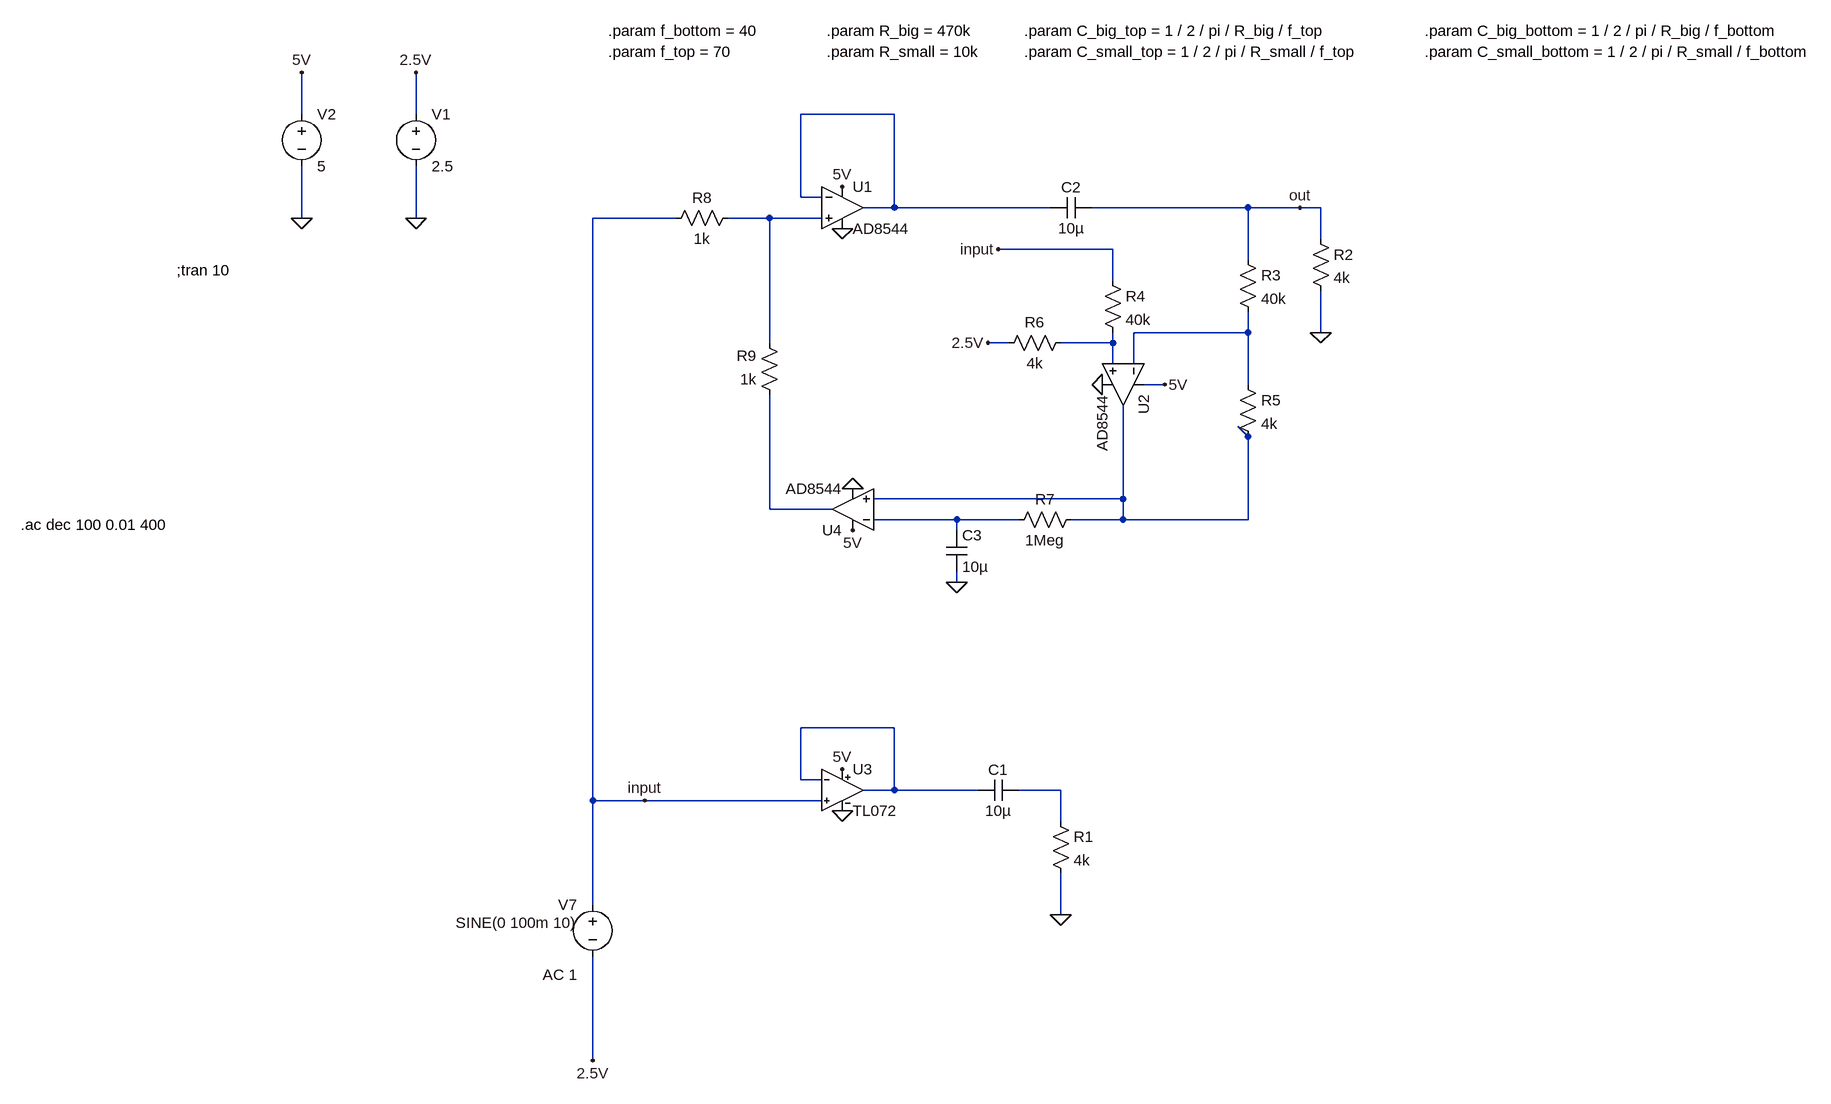
[diagram p0: schematic HP_ac.asc]
HP_ac.asc, the LTspice schematic file:
Version 4
SHEET 1 2972 1716
WIRE -1456 -272 -1456 -336
WIRE -1280 -272 -1280 -336
WIRE -544 -272 -688 -272
WIRE -688 -144 -688 -272
WIRE -656 -144 -688 -144
WIRE -544 -128 -544 -272
WIRE -544 -128 -592 -128
WIRE -304 -128 -544 -128
WIRE 0 -128 -240 -128
WIRE 80 -128 0 -128
WIRE 112 -128 80 -128
WIRE -1456 -112 -1456 -192
WIRE -1280 -112 -1280 -192
WIRE -880 -112 -1008 -112
WIRE -736 -112 -800 -112
WIRE -656 -112 -736 -112
WIRE 112 -80 112 -128
WIRE -208 -64 -384 -64
WIRE 0 -48 0 -128
WIRE -208 -16 -208 -64
WIRE 0 64 0 32
WIRE 0 64 -176 64
WIRE 112 64 112 0
WIRE -736 80 -736 -112
WIRE -368 80 -400 80
WIRE -208 80 -208 64
WIRE -208 80 -288 80
WIRE -208 112 -208 80
WIRE -176 112 -176 64
WIRE -128 144 -160 144
WIRE 0 144 0 64
WIRE 0 224 -16 208
WIRE -192 320 -192 176
WIRE -192 320 -576 320
WIRE -736 336 -736 160
WIRE -640 336 -736 336
WIRE -448 352 -576 352
WIRE -352 352 -448 352
WIRE -192 352 -192 320
WIRE -192 352 -272 352
WIRE 0 352 0 224
WIRE 0 352 -192 352
WIRE -448 368 -448 352
WIRE -448 448 -448 432
WIRE -544 672 -688 672
WIRE -688 752 -688 672
WIRE -656 752 -688 752
WIRE -544 768 -544 672
WIRE -544 768 -592 768
WIRE -416 768 -544 768
WIRE -288 768 -352 768
WIRE -1008 784 -1008 -112
WIRE -928 784 -1008 784
WIRE -656 784 -928 784
WIRE -288 816 -288 768
WIRE -1008 944 -1008 784
WIRE -288 960 -288 896
WIRE -1008 1184 -1008 1024
FLAG -1456 -112 0
FLAG -1456 -336 5V
FLAG -1280 -112 0
FLAG -1280 -336 2.5V
FLAG -624 800 0
FLAG -624 736 5V
FLAG -1008 1184 2.5V
FLAG -288 960 0
FLAG -624 -96 0
FLAG -624 -160 5V
FLAG 112 64 0
FLAG -928 784 input
FLAG 80 -128 out
FLAG -224 144 0
FLAG -128 144 5V
FLAG -384 -64 input
FLAG -400 80 2.5V
FLAG -448 448 0
FLAG -608 304 0
FLAG -608 368 5V
SYMBOL voltage -1456 -288 R0
WINDOW 123 0 0 Left 0
WINDOW 39 0 0 Left 0
SYMATTR InstName V2
SYMATTR Value 5
SYMBOL voltage -1008 928 M0
WINDOW 123 24 124 Left 2
WINDOW 39 0 0 Left 0
WINDOW 3 24 44 Left 2
SYMATTR Value2 AC 1
SYMATTR InstName V7
SYMATTR Value SINE(0 100m 10)
SYMBOL voltage -1280 -288 R0
WINDOW 123 0 0 Left 0
WINDOW 39 0 0 Left 0
SYMATTR InstName V1
SYMATTR Value 2.5
SYMBOL ZZZ\\OpAmp\\TL072 -624 768 R0
SYMATTR InstName U3
SYMBOL cap -352 752 R90
WINDOW 0 0 32 VBottom 2
WINDOW 3 32 32 VTop 2
SYMATTR InstName C1
SYMATTR Value 10µ
SYMBOL res -304 800 R0
SYMATTR InstName R1
SYMATTR Value 4k
SYMBOL cap -240 -144 R90
WINDOW 0 0 32 VBottom 2
WINDOW 3 32 32 VTop 2
SYMATTR InstName C2
SYMATTR Value 10µ
SYMBOL res 96 -96 R0
SYMATTR InstName R2
SYMATTR Value 4k
SYMBOL OpAmps\\AD8544 -624 -192 R0
SYMATTR InstName U1
SYMBOL OpAmps\\AD8544 -128 144 R90
SYMATTR InstName U2
SYMBOL res -16 -64 R0
SYMATTR InstName R3
SYMATTR Value 40k
SYMBOL res -224 -32 R0
SYMATTR InstName R4
SYMATTR Value 40k
SYMBOL res -16 128 R0
SYMATTR InstName R5
SYMATTR Value 4k
SYMBOL res -272 64 R90
WINDOW 0 0 56 VBottom 2
WINDOW 3 32 56 VTop 2
SYMATTR InstName R6
SYMATTR Value 4k
SYMBOL res -256 336 R90
WINDOW 0 0 56 VBottom 2
WINDOW 3 32 56 VTop 2
SYMATTR InstName R7
SYMATTR Value 1Meg
SYMBOL cap -464 368 R0
SYMATTR InstName C3
SYMATTR Value 10µ
SYMBOL OpAmps\\AD8544 -608 400 R180
SYMATTR InstName U4
SYMBOL res -784 -128 R90
WINDOW 0 0 56 VBottom 2
WINDOW 3 32 56 VTop 2
SYMATTR InstName R8
SYMATTR Value 1k
SYMBOL res -720 176 R180
WINDOW 0 36 76 Left 2
WINDOW 3 36 40 Left 2
SYMATTR InstName R9
SYMATTR Value 1k
TEXT -1648 -32 Left 2 !;tran 10
TEXT -1888 360 Left 2 !.ac dec 100 0.01 400
TEXT -984 -400 Left 2 !.param f_bottom = 40
TEXT -984 -368 Left 2 !.param f_top = 70
TEXT -648 -400 Left 2 !.param R_big = 470k
TEXT -648 -368 Left 2 !.param R_small = 10k
TEXT -344 -400 Left 2 !.param C_big_top = 1 / 2 / pi / R_big / f_top
TEXT -344 -368 Left 2 !.param C_small_top = 1 / 2 / pi / R_small / f_top
TEXT 272 -400 Left 2 !.param C_big_bottom = 1 / 2 / pi / R_big / f_bottom
TEXT 272 -368 Left 2 !.param C_small_bottom = 1 / 2 / pi / R_small / f_bottom

The netlist it stands for:
* HP_ac.asc
V2 5V 0 5
V7 input 2.5V SINE(0 100m 10) AC 1
V1 2.5V 0 2.5
XU3 input N008 5V 0 N008 TL072  ; pins 1 2 3 4 5
C1 N009 N008 10µ
R1 N009 0 4k
C2 out N001 10µ
R2 out 0 4k
XU1 N002 N001 5V 0 N001 AD8544  ; pins In+ In- V+ V- OUT
XU2 N004 N003 5V 0 N005 AD8544  ; pins In+ In- V+ V- OUT
R3 out N003 40k
R4 input N004 40k
R5 N003 N005 4k
R6 N004 2.5V 4k
R7 N005 N007 1Meg
C3 N007 0 10µ
XU4 N005 N007 5V 0 N006 AD8544  ; pins In+ In- V+ V- OUT
R8 N002 input 1k
R9 N006 N002 1k
;tran 10
.ac dec 100 0.01 400
.param f_bottom = 40
.param f_top = 70
.param R_big = 470k
.param R_small = 10k
.param C_big_top = 1 / 2 / pi / R_big / f_top
.param C_small_top = 1 / 2 / pi / R_small / f_top
.param C_big_bottom = 1 / 2 / pi / R_big / f_bottom
.param C_small_bottom = 1 / 2 / pi / R_small / f_bottom
.lib TL072.cir
.backanno
.end